# Altium schematic sheet E17-PDU-LOAD_2.SchDoc
size A4
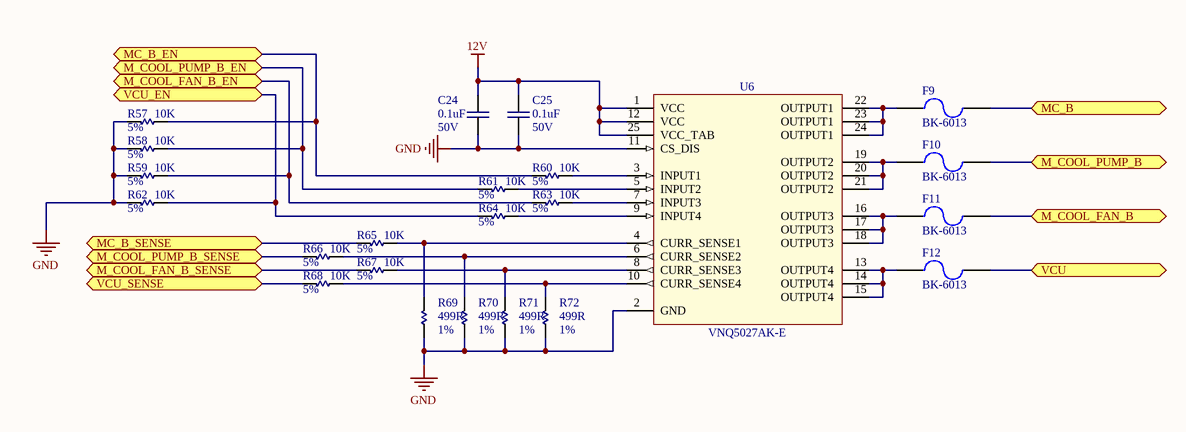
[diagram p0: E17-PDU-LOAD_2.SchDoc]

## Parts
C24  value 0.1uF  Voltage: 50V  [C0805]  (hidden comment: C_0805_Generic)
C25  value 0.1uF  Voltage: 50V  [C0805]  (hidden comment: C_0805_Generic)
F9  F_BK-6013  [BK-6013]  (value not drawn)
F10  F_BK-6013  [BK-6013]  (value not drawn)
F11  F_BK-6013  [BK-6013]  (value not drawn)
F12  F_BK-6013  [BK-6013]  (value not drawn)
R57  value 10K  Tolerance: 5%  [R0603]  (hidden comment: R_0603_Generic)
R58  value 10K  Tolerance: 5%  [R0603]  (hidden comment: R_0603_Generic)
R59  value 10K  Tolerance: 5%  [R0603]  (hidden comment: R_0603_Generic)
R60  value 10K  Tolerance: 5%  [R0603]  (hidden comment: R_0603_Generic)
R61  value 10K  Tolerance: 5%  [R0603]  (hidden comment: R_0603_Generic)
R62  value 10K  Tolerance: 5%  [R0603]  (hidden comment: R_0603_Generic)
R63  value 10K  Tolerance: 5%  [R0603]  (hidden comment: R_0603_Generic)
R64  value 10K  Tolerance: 5%  [R0603]  (hidden comment: R_0603_Generic)
R65  value 10K  Tolerance: 5%  [R0603]  (hidden comment: R_0603_Generic)
R66  value 10K  Tolerance: 5%  [R0603]  (hidden comment: R_0603_Generic)
R67  value 10K  Tolerance: 5%  [R0603]  (hidden comment: R_0603_Generic)
R68  value 10K  Tolerance: 5%  [R0603]  (hidden comment: R_0603_Generic)
R69  value 499R  Tolerance: 1%  [R0603]  (hidden comment: R_0603_Generic)
R70  value 499R  Tolerance: 1%  [R0603]  (hidden comment: R_0603_Generic)
R71  value 499R  Tolerance: 1%  [R0603]  (hidden comment: R_0603_Generic)
R72  value 499R  Tolerance: 1%  [R0603]  (hidden comment: R_0603_Generic)
U6  MFG_PN: VNQ5027AK-E  [PowerSSO-24]  (hidden comment: U_VNQ5027AK-E)

## Ports
M_COOL_FAN_B, M_COOL_FAN_B_EN, M_COOL_FAN_B_SENSE, M_COOL_PUMP_B, M_COOL_PUMP_B_EN, M_COOL_PUMP_B_SENSE, MC_B, MC_B_EN, MC_B_SENSE, VCU, VCU_EN, VCU_SENSE

## Nets
12V: C24.1(EGND) C25.1(EGND) U6.1(VCC) U6.12(VCC) U6.25(VCC_TAB)
GND: C24.2 C25.2 R57.1 R58.1 R59.1 R62.1 R69.2 R70.2 R71.2 R72.2 U6.2(GND) U6.11(CS_DIS)
M_COOL_FAN_B: F11.2 ; port M_COOL_FAN_B
M_COOL_FAN_B_EN: R59.2 R63.1 ; port M_COOL_FAN_B_EN
M_COOL_FAN_B_SENSE: R67.1 ; port M_COOL_FAN_B_SENSE
M_COOL_PUMP_B: F10.2 ; port M_COOL_PUMP_B
M_COOL_PUMP_B_EN: R58.2 R61.1 ; port M_COOL_PUMP_B_EN
M_COOL_PUMP_B_SENSE: R66.1 ; port M_COOL_PUMP_B_SENSE
MC_B: F9.2 ; port MC_B
MC_B_EN: R57.2 R60.1 ; port MC_B_EN
MC_B_SENSE: R65.1 ; port MC_B_SENSE
VCU: F12.2 ; port VCU
VCU_EN: R62.2 R64.1 ; port VCU_EN
VCU_SENSE: R68.1 ; port VCU_SENSE
NetF9_1: F9.1 U6.22(OUTPUT1) U6.23(OUTPUT1) U6.24(OUTPUT1)
NetF10_1: F10.1 U6.19(OUTPUT2) U6.20(OUTPUT2) U6.21(OUTPUT2)
NetF11_1: F11.1 U6.16(OUTPUT3) U6.17(OUTPUT3) U6.18(OUTPUT3)
NetF12_1: F12.1 U6.13(OUTPUT4) U6.14(OUTPUT4) U6.15(OUTPUT4)
NetR60_2: R60.2 U6.3(INPUT1)
NetR61_2: R61.2 U6.5(INPUT2)
NetR63_2: R63.2 U6.7(INPUT3)
NetR64_2: R64.2 U6.9(INPUT4)
NetR65_2: R65.2 R69.1 U6.4(CURR_SENSE1)
NetR66_2: R66.2 R70.1 U6.6(CURR_SENSE2)
NetR67_2: R67.2 R71.1 U6.8(CURR_SENSE3)
NetR68_2: R68.2 R72.1 U6.10(CURR_SENSE4)

## Library data of the parts
C24 C25 = C_0805_Generic: Generic 0805 Capacitor; Tolerance: 10%; Supplier: Digikey; Supplier_PN: 399-1170-1-ND
F9-F12 = F_BK-6013: FUSE HOLDER BLADE PCB; MFG: MPD; Supplier: Digikey; Supplier_PN: BK-6013-ND; MFG_PN: BK-6013
R57-R68 = R_0603_Generic: Generic 0603 Resistor; Power: 1/10W; Supplier: Digikey; Supplier_PN: P10KGCT-ND
R69-R72 = R_0603_Generic: Generic 0603 Resistor; Power: 1/8W; Supplier: Digikey; Supplier_PN: RNCP0603FTD499RCT-ND
U6 = U_VNQ5027AK-E: LOAD CHANNEL HIGH SIDE 42A 4 Channel; MFG: STmicroelectronics; Supplier_PN: 497-11715-1-ND; Supplier: Digikey